# Altium schematic sheet hv_io_bms.SchDoc
size A4; Organization: Badgerloop; Address1: 133 Engineering Research; Address2: Building; Address3: Madison, WI 53715
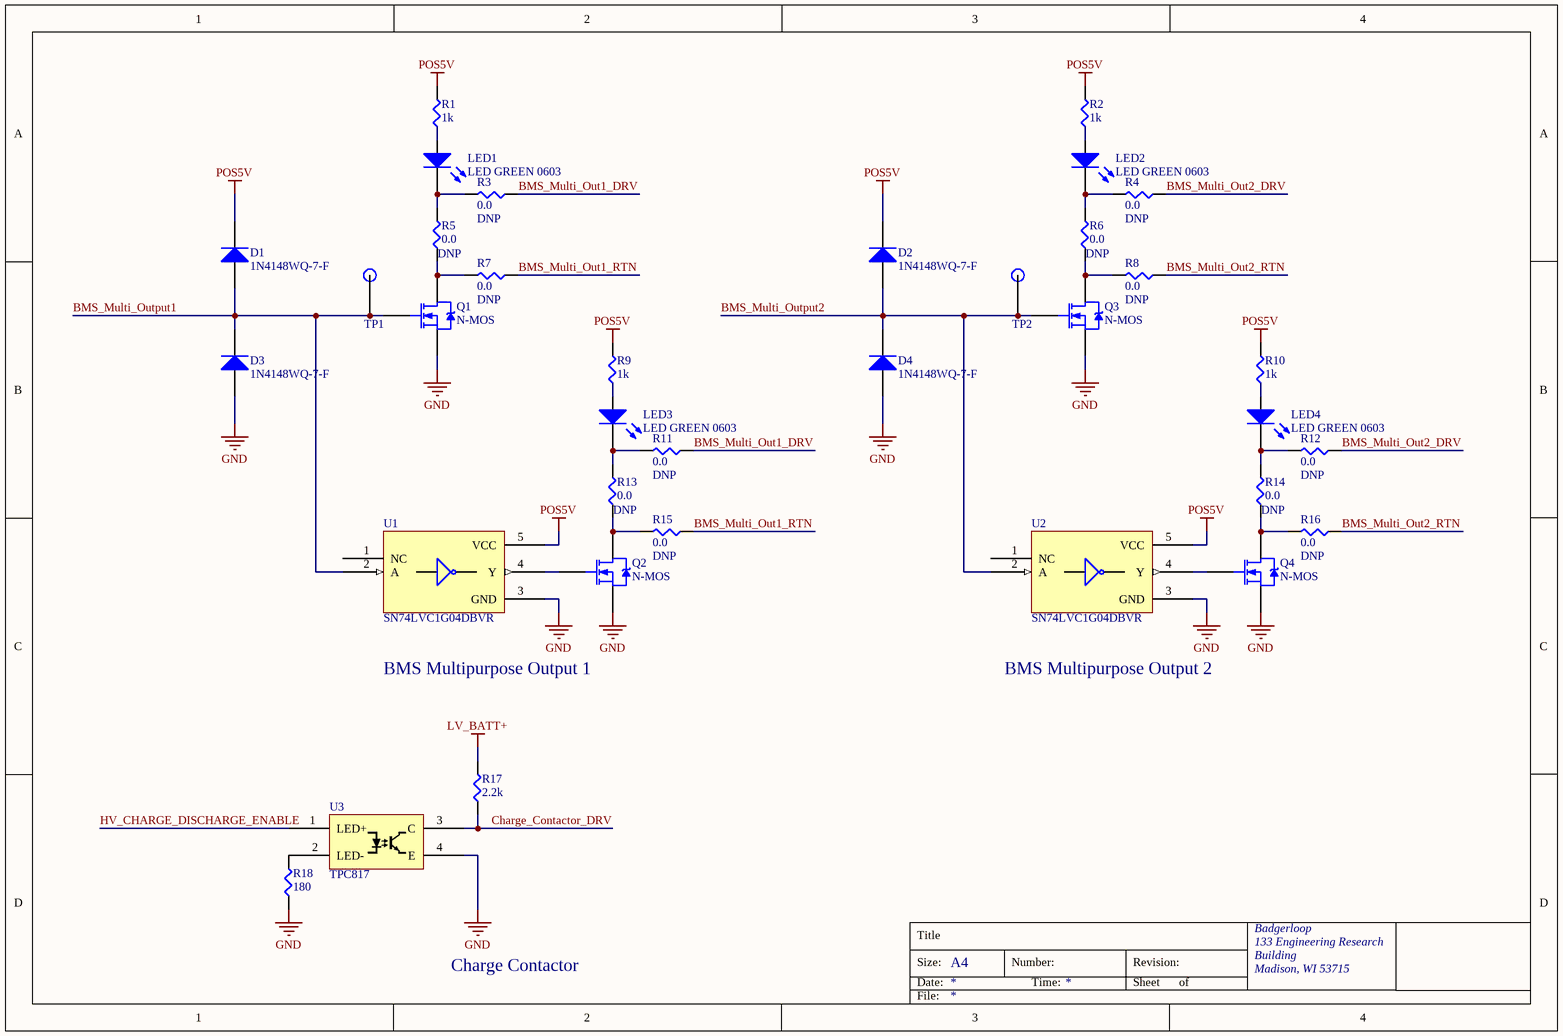
[diagram p0: hv_io_bms.SchDoc]

## Parts
D1  1N4148WQ-7-F  [SODFL370X100-2N]
D2  1N4148WQ-7-F  [SODFL370X100-2N]
D3  1N4148WQ-7-F  [SODFL370X100-2N]
D4  1N4148WQ-7-F  [SODFL370X100-2N]
LED1  LED GREEN 0603  [LED 0603 GREEN]
LED2  LED GREEN 0603  [LED 0603 GREEN]
LED3  LED GREEN 0603  [LED 0603 GREEN]
LED4  LED GREEN 0603  [LED 0603 GREEN]
Q1  N-MOS  [DPAK228P991X238-3N]
Q2  N-MOS  [DPAK228P991X238-3N]
Q3  N-MOS  [DPAK228P991X238-3N]
Q4  N-MOS  [DPAK228P991X238-3N]
R1  1k  [SMD-0402-RES]
R2  1k  [SMD-0402-RES]
R3  0.0  [SMD-0402-RES]
R4  0.0  [SMD-0402-RES]
R5  0.0  [SMD-0402-RES]
R6  0.0  [SMD-0402-RES]
R7  0.0  [SMD-0402-RES]
R8  0.0  [SMD-0402-RES]
R9  1k  [SMD-0402-RES]
R10  1k  [SMD-0402-RES]
R11  0.0  [SMD-0402-RES]
R12  0.0  [SMD-0402-RES]
R13  0.0  [SMD-0402-RES]
R14  0.0  [SMD-0402-RES]
R15  0.0  [SMD-0402-RES]
R16  0.0  [SMD-0402-RES]
R17  2.2k  [SMD-1206-RES]
R18  180  [SMD-1206-RES]
TP1  TP  [Test Point]  (value not drawn)
TP2  TP  [Test Point]  (value not drawn)
U1  SN74LVC1G04DBVR  [DBV5-L]
U2  SN74LVC1G04DBVR  [DBV5-L]
U3  TPC817  [SOT200P1005X328-5N]

## Nets
GND: D3.1(A) D4.1(A) Q1.3(S) Q2.3(S) Q3.3(S) Q4.3(S) R18.1 U1.3(GND) U2.3(GND) U3.4(E)
LV_BATT+: R17.2
POS5V: D1.2(K) D2.2(K) R1.2 R2.2 R9.2 R10.2 U1.5(VCC) U2.5(VCC)
BMS_Multi_Out1_DRV: R3.1 R11.1
BMS_Multi_Out1_RTN: R7.1 R15.1
BMS_Multi_Out2_DRV: R4.1 R12.1
BMS_Multi_Out2_RTN: R8.1 R16.1
BMS_Multi_Output1: D1.1(A) D3.2(K) Q1.1(G) TP1.1 U1.2(A)
BMS_Multi_Output2: D2.1(A) D4.2(K) Q3.1(G) TP2.1 U2.2(A)
Charge_Contactor_DRV: R17.1 U3.3(C)
HV_CHARGE_DISCHARGE_ENABLE: U3.1(LED+)
NetLED1_1: LED1.1(A) R1.1
NetLED1_2: LED1.2(K) R3.2 R5.2
NetLED2_1: LED2.1(A) R2.1
NetLED2_2: LED2.2(K) R4.2 R6.2
NetLED3_1: LED3.1(A) R9.1
NetLED3_2: LED3.2(K) R11.2 R13.2
NetLED4_1: LED4.1(A) R10.1
NetLED4_2: LED4.2(K) R12.2 R14.2
NetQ1_4: Q1.4(D) R5.1 R7.2
NetQ2_1: Q2.1(G) U1.4(Y)
NetQ2_4: Q2.4(D) R13.1 R15.2
NetQ3_4: Q3.4(D) R6.1 R8.2
NetQ4_1: Q4.1(G) U2.4(Y)
NetQ4_4: Q4.4(D) R14.1 R16.2
NetR18_2: R18.2 U3.2(LED-)

Not connected (* = marked no-connect by the designer): U1 1(NC); U2 1(NC)

## Notes on the sheet
- BMS Multipurpose Output 1
- BMS Multipurpose Output 2
- Charge Contactor
- Title
- Size:
- Date:
- A4
- Number:
- Time:
- Revision:
- Sheet
- of
- File:

## Library data of the parts
D1-D4 = 1N4148WQ-7-F: Diodes - General Purpose, Power, Switching SMT Fast Switching Diode; Manufacturer: Diodes Inc.; Digikey Link: https://www.digikey.com/product-detail/en/diodes-incorporated/1N4148WQ-7-F/1N4148WQ-7-FDITR-ND/8136126; Manufacturer P/N: 1N4148WQ-7-F; Digikey P/N: 1N4148WQ-7-FDITR-ND
LED1-LED4 = LED GREEN 0603: Manufacturer: Lite-On Inc.; Manufacturer P/N: LTST-C190KGKT; Digikey P/N: 160-1435-1-ND; Package / Case: 0603; Color: GREEN
Q1-Q4 = N-MOS: N-Channel Power MOSFET, 12 A, 60 V; Manufacturer: ON SEMI; Manufacturer P/N: NTD3055L104T4G; Digikey Link: https://www.digikey.com/product-detail/en/on-semiconductor/NTD3055L104T4G/NTD3055L104T4GOSDKR-ND/1749196; Digikey P/N: NTD3055L104T4GOSDKR-ND
R1 R2 R9 R10 = ERJ-2GEJ102X: RES SMD 1K OHM 5% 1/10W 0402; Manufacturer: Panasonic Electronic Components; Factory Stock: 0; Unit Price (USD): 0.00350; @ qty: 1500; Minimum Quantity: 1; Power (Watts): 0.1W, 1/10W; Temperature Coefficient: ±200ppm/°C; Part Number: ERJ-2GEJ102X; Datasheets: http://industrial.panasonic.com/www-cgi/jvcr13pz.cgi?E+PZ+3+AOA0001+ERJ2GEJ102X+7+WW; Image: //media.digikey.com/Photos/Panasonic%20Photos/ERJ-PA2-Series.jpg; Digi-Key Part Number: P1.0KJCT-ND; Quantity Available: 1939857; Packaging: Cut Tape (CT); Series: ERJ; Part Status: Active; Value: 1k; Tolerance: ±5%; Composition: Thick Film; Features: Automotive AEC-Q200; Operating Temperature: -55°C ~ 155°C; Package / Case: 0402 (1005 Metric); Supplier Device Package: 0402; Size / Dimension: 0.039" L x 0.020" W (1.00mm x 0.50mm); Height - Seated (Max): 0.016" (0.40mm); Number of Terminations: 2; Failure Rate: -; Digikey P/N: ERJ-2GEJ102X
R3-R8 R11-R16 = ERJ-2GE0R00X: RES SMD 0.0OHM JUMPER 1/10W 0402; Manufacturer: Panasonic Electronic Components; Factory Stock: 0; Unit Price (USD): 0.00384; @ qty: 1500; Minimum Quantity: 1; Power (Watts): 0.1W, 1/10W; Part Number: ERJ-2GE0R00X; Datasheets: http://industrial.panasonic.com/www-cgi/jvcr13pz.cgi?E+PZ+3+AOA0001+ERJ2GE0R00X+7+WW; Image: //media.digikey.com/Photos/Panasonic%20Photos/ERJ-PA2-Series.jpg; Digi-Key Part Number: P0.0JCT-ND; Quantity Available: 3152483; Packaging: Cut Tape (CT); Series: ERJ; Part Status: Active; Value: 0.0; Tolerance: Jumper; Composition: Thick Film; Features: Automotive AEC-Q200; Temperature Coefficient: -; Operating Temperature: -55°C ~ 155°C; Package / Case: 0402 (1005 Metric); Supplier Device Package: 0402; Size / Dimension: 0.039" L x 0.020" W (1.00mm x 0.50mm); Height - Seated (Max): 0.016" (0.40mm); Number of Terminations: 2; Failure Rate: -; Digikey P/N: ERJ-2GE0R00X; DNP: DNP
R17 = ERJ-8ENF2201V: RES SMD 2.2K OHM 1% 1/4W 1206; Manufacturer: Panasonic Electronic Components; Factory Stock: 0; Unit Price (USD): 0.00933; @ qty: 1500; Minimum Quantity: 1; Power (Watts): 0.25W, 1/4W; Temperature Coefficient: ±100ppm/°C; Part Number: ERJ-8ENF2201V; Datasheets: http://industrial.panasonic.com/www-cgi/jvcr13pz.cgi?E+PZ+3+AOA0002+ERJ8ENF2201V+7+WW; Image: //media.digikey.com/Renders/Panasonic%20Renders/ERJ-1206%20Pkg.jpg; Digi-Key Part Number: P2.20KFCT-ND; Quantity Available: 220817; Packaging: Cut Tape (CT); Series: ERJ; Part Status: Active; Value: 2.2k; Tolerance: ±1%; Composition: Thick Film; Features: Automotive AEC-Q200; Operating Temperature: -55°C ~ 155°C; Package / Case: 1206 (3216 Metric); Supplier Device Package: 1206; Size / Dimension: 0.126" L x 0.063" W (3.20mm x 1.60mm); Height - Seated (Max): 0.028" (0.70mm); Number of Terminations: 2; Failure Rate: -; Digikey P/N: ERJ-8ENF2201V
R18 = ERJ-8ENF1800V: RES SMD 180 OHM 1% 1/4W 1206; Manufacturer: Panasonic Electronic Components; Factory Stock: 0; Unit Price (USD): 0.00933; @ qty: 1500; Minimum Quantity: 1; Power (Watts): 0.25W, 1/4W; Temperature Coefficient: ±100ppm/°C; Part Number: ERJ-8ENF1800V; Datasheets: http://industrial.panasonic.com/www-cgi/jvcr13pz.cgi?E+PZ+3+AOA0002+ERJ8ENF1800V+7+WW; Image: //media.digikey.com/Renders/Panasonic%20Renders/ERJ-1206%20Pkg.jpg; Digi-Key Part Number: P180FCT-ND; Quantity Available: 4031; Packaging: Cut Tape (CT); Series: ERJ; Part Status: Active; Value: 180; Tolerance: ±1%; Composition: Thick Film; Features: Automotive AEC-Q200; Operating Temperature: -55°C ~ 155°C; Package / Case: 1206 (3216 Metric); Supplier Device Package: 1206; Size / Dimension: 0.126" L x 0.063" W (3.20mm x 1.60mm); Height - Seated (Max): 0.028" (0.70mm); Number of Terminations: 2; Failure Rate: -
U1 U2 = SN74LVC1G04DBVR: Manufacturer: TI; Digikey Link: https://www.digikey.com/product-detail/en/texas-instruments/SN74LVC1G04DBVR/296-11599-1-ND/385738; Manufacturer P/N: SN74LVC1G04DBVR; Digikey P/N: 296-11599-1-ND
U3 = TPC817: OPTOISO 5KV TRANS 4SOP; Manufacturer: Taiwan Semi; Manufacturer P/N: TPC817S1B RAG; Digikey Link: https://www.digikey.com/product-detail/en/taiwan-semiconductor-corporation/TPC817S1B-RAG/TPC817S1BRAGCT-ND/7359679; Digikey P/N: TPC817S1BRAGCT-ND